# Altium schematic sheet LPCB220 - BRAKE MLP CHANNEL.SchDoc
size A3; Address1: Factory 10; Address2: 9-13 Dingley Avenue, Dandeong, VICTORIA 3175, AUSTRALIA; DocumentNumber: 12; Revision: 1; SheetNumber: 12; SheetTotal: 18; Lockie__PCB_SUB_ASSEMBLY: MLP Input Channel; Lockie__PCB_ASSEMBLY: Brake Control; Lockie__LDL: LPCB220; Lockie__PCB_DESCRIPTION: Redundant Stepper Node
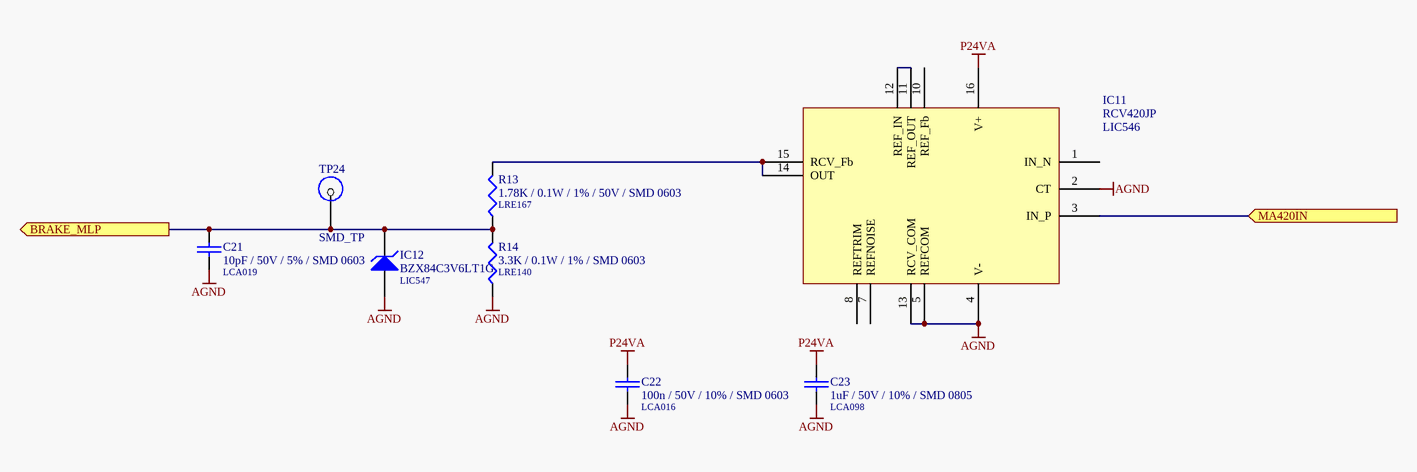
[diagram p0: LPCB220 - BRAKE MLP CHANNEL.SchDoc]

## Parts
C21  10pF / 50V / 5% / SMD 0603  LDL_NUMBER: LCA019  [LFP011__CC1608-0603-IPC7351_B]
C22  100n / 50V / 10% / SMD 0603  LDL_NUMBER: LCA016  [LFP011__CC1608-0603-IPC7351_B]
C23  1uF / 50V / 10% / SMD 0805  LDL_NUMBER: LCA098  [LFP010__CC2012-0805-IPC7351_B]
IC11  RCV420JP  LDL_NUMBER: LIC546  [DIP-P16/X1.5]
IC12  BZX84C3V6LT1G  LDL_NUMBER: LIC547  [LFP021__SOT23]
R13  1.78K / 0.1W / 1% / 50V / SMD 0603  LDL_NUMBER: LRE167  [LFP020__CR1608-0603-IPC7351_B]
R14  3.3K / 0.1W / 1% / SMD 0603  LDL_NUMBER: LRE140  [LFP020__CR1608-0603-IPC7351_B]
TP24  SMD_TP  [SMD-TP]  (no BOM)

## Ports
BRAKE_MLP (out), MA420IN (in)

## Nets
AGND: C21.2 C22.2 C23.2 IC11.2(CT) IC11.4(V-) IC11.5(REFCOM) IC11.13(RCV_COM) IC12.1(A) R14.1
P24VA: C22.1 C23.1 IC11.16(V+)
BRAKE_MLP: C21.1 IC12.3(K) R13.1 R14.2 TP24.1 ; port BRAKE_MLP
MA420IN: IC11.3(IN_P) ; port MA420IN
NetIC11_11: IC11.11(REF_OUT) IC11.12(REF_IN)
NetIC11_14: IC11.14(OUT) IC11.15(RCV_Fb) R13.2

Not connected (* = marked no-connect by the designer): IC11 1(IN_N) 7(REFNOISE) 8(REFTRIM) 10(REF_Fb)

## Notes on the sheet
- PCB COMPONENT DESCRIPTION
- LDL NUMBER
- Assembly Details
- Size
- Drawing File Name
- Revision
- http://rloop.org
- Scale
- A3
- Sheet Details
- N.T.S
- Sheet:
- Of:

## Library data of the parts
C21 = 10pF / 50V / 5% / SMD 0603: Capacitor, Ceramic Chip, 10pF, 50V, 5%, SMD 0603 [LCA019]; Value: 10p; FMEDA__OPERATING__VOLTAGE_MAX: 3.3; FMEDA__OPERATING__VOLTAGE_MIN: 0; FMEDA__OPERATING__TEMP_MAX: 50; FMEDA__OPERATING__TEMP_MIN: -20; FMEDA__OPERATING__TEMP_TYP: 27; FMEDA__CHANNEL: COM; FMEDA__OPERATING__VOLTAGE_TYP: 3.3; FMEDA__FUNCTION_IN_SYSTEM: *
C22 = 100n / 50V / 10% / SMD 0603: Capacitor, Ceramic Chip, 100nF (0.1uF), 50V, 5%, SMD 0603 [LCA016]; FMEDA__OPERATING__VOLTAGE_MIN: 0; FMEDA__OPERATING__VOLTAGE_MAX: 3.3; FMEDA__OPERATING__TEMP_MIN: -20; FMEDA__OPERATING__TEMP_TYP: 27; FMEDA__OPERATING__TEMP_MAX: 50; FMEDA__CHANNEL: COM; Value: 100n; FMEDA__FUNCTION_IN_SYSTEM: *; FMEDA__OPERATING__VOLTAGE_TYP: 3.3
C23 = 1uF / 50V / 10% / SMD 0805: Capacitor, Ceramic Chip, 1uF, 50V, SMD 0805 [LCA098]; Value: 1u; FMEDA__OPERATING__VOLTAGE_MAX: 3.3; FMEDA__OPERATING__VOLTAGE_MIN: 0; FMEDA__OPERATING__TEMP_MAX: 50; FMEDA__OPERATING__TEMP_MIN: -20; FMEDA__OPERATING__TEMP_TYP: 27; FMEDA__CHANNEL: COM; FMEDA__OPERATING__VOLTAGE_TYP: 3.3; FMEDA__FUNCTION_IN_SYSTEM: *
IC11 = RCV420JP: IC, 4-20mA Interface, DIP16 [LIC546]
IC12 = BZX84C3V6LT1G: Diode, Zener, 3.6V, 0.225W, SMD [LIC083]; FMEDA__OPERATING__TEMP_MAX: 50; FMEDA__OPERATING__TEMP_MIN: -20; FMEDA__OPERATING__TEMP_TYP: 27; FMEDA__OPERATING__VOLTAGE_MAX: 0; FMEDA__CHANNEL: COM; Revision: 17-Jul-2002: Re-released for DXP Platform.; FMEDA__FUNCTION_IN_SYSTEM: *; FMEDA__OPERATING__VOLTAGE_MIN: 0; FMEDA__OPERATING__VOLTAGE_TYP: 0; FMEDA__OPERATING__CURRENT_MAX: 0; FMEDA__OPERATING__CURRENT_MIN: 0; FMEDA__OPERATING__CURRENT_TYP: 0
R13 = 1.78K / 0.1W / 1% / 50V / SMD 0603: Resistor, Ceramic Chip, 1.78K, 0.1W, 1%, SMD 0603 [LRE167]; FMEDA__OPERATING__POWER_MAX: 0.01; FMEDA__OPERATING__POWER_MIN: 0; FMEDA__OPERATING__TEMP_MAX: 50; FMEDA__OPERATING__TEMP_MIN: -20; FMEDA__OPERATING__TEMP_TYP: 27; FMEDA__CHANNEL: COM; Value: 1.78K; FMEDA__OPERATING__VOLTAGE_MAX: 0; FMEDA__OPERATING__VOLTAGE_MIN: 0; FMEDA__OPERATING__VOLTAGE_TYP: 0; FMEDA__FUNCTION_IN_SYSTEM: *
R14 = 3.3K / 0.1W / 1% / SMD 0603: Resistor, Ceramic Chip, 3.3K0, 0.1W, 1%, SMD 0603 [LRE140]; FMEDA__OPERATING__POWER_MAX: 0; FMEDA__OPERATING__TEMP_MAX: 50; FMEDA__OPERATING__TEMP_MIN: -20; FMEDA__OPERATING__TEMP_TYP: 27; FMEDA__CHANNEL: COM; Value: 3.3K; FMEDA__OPERATING__POWER_MIN: 0; FMEDA__OPERATING__VOLTAGE_MAX: 0; FMEDA__OPERATING__VOLTAGE_MIN: 0; FMEDA__OPERATING__VOLTAGE_TYP: 0; FMEDA__FUNCTION_IN_SYSTEM: *
TP24 = SMD_TP: SMD Test Point; FMEDA__CHANNEL: COM; FMEDA__OPERATING__CURRENT_MAX: 0; FMEDA__OPERATING__TEMP_MAX: 50; FMEDA__OPERATING__TEMP_MIN: -20; FMEDA__OPERATING__TEMP_TYP: 27; FMEDA__OPERATING__VOLTAGE_MAX: 16; FMEDA__OPERATING__VOLTAGE_TYP: 12; FMEDA__OPERATING__CURRENT_MIN: 0; FMEDA__OPERATING__CURRENT_TYP: 0; FMEDA__OPERATING__VOLTAGE_MIN: 0